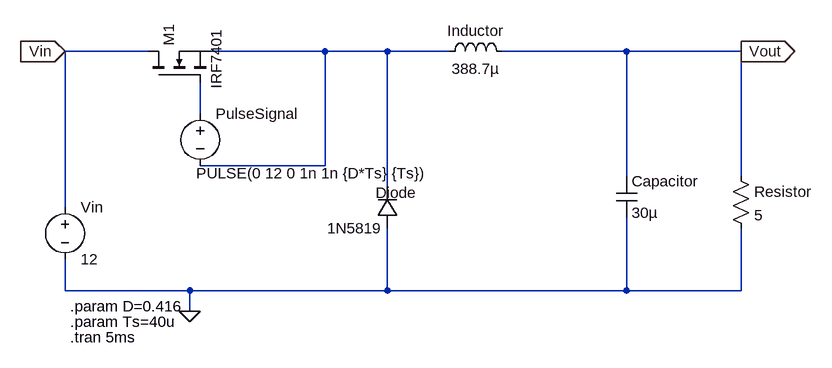
[diagram p0: schematic BuckConvertor.asc]
BuckConvertor.asc, the LTspice schematic file:
Version 4.1
SHEET 1 1068 680
WIRE 32 -80 -96 -80
WIRE 304 -80 128 -80
WIRE 400 -80 304 -80
WIRE 496 -80 400 -80
WIRE 768 -80 576 -80
WIRE 944 -80 768 -80
WIRE 112 16 112 -32
WIRE 304 96 304 -80
WIRE 304 96 112 96
WIRE 768 112 768 -80
WIRE 944 112 944 -80
WIRE 400 128 400 -80
WIRE -96 160 -96 -80
WIRE -96 288 -96 240
WIRE 96 288 -96 288
WIRE 400 288 400 192
WIRE 400 288 96 288
WIRE 768 288 768 176
WIRE 768 288 400 288
WIRE 944 288 944 192
WIRE 944 288 768 288
WIRE 96 320 96 288
FLAG 96 320 0
FLAG -96 -80 Vin
IOPIN -96 -80 In
FLAG 944 -80 Vout
IOPIN 944 -80 Out
SYMBOL ind 480 -64 R270
WINDOW 0 32 56 VTop 2
WINDOW 3 5 56 VBottom 2
SYMATTR InstName Inductor
SYMATTR Value 388.7µ
SYMATTR SpiceLine Rser=50m
SYMBOL cap 752 112 R0
SYMATTR InstName Capacitor
SYMATTR Value 30µ
SYMATTR SpiceLine Rser=5m
SYMBOL res 928 96 R0
SYMATTR InstName Resistor
SYMATTR Value 5
SYMBOL voltage 112 0 R0
WINDOW 3 -6 107 Left 2
WINDOW 123 0 0 Left 0
WINDOW 39 0 0 Left 0
SYMATTR InstName PulseSignal
SYMATTR Value PULSE(0 12 0 1n 1n {D*Ts} {Ts})
SYMBOL diode 416 192 R180
WINDOW 0 -29 55 Left 2
WINDOW 3 24 0 Left 2
SYMATTR InstName Diode
SYMATTR Value 1N5819
SYMBOL voltage -96 144 R0
WINDOW 123 0 0 Left 0
WINDOW 39 0 0 Left 0
SYMATTR InstName Vin
SYMATTR Value 12
SYMBOL nmos 32 -32 R270
WINDOW 3 -10 105 Left 2
SYMATTR InstName M1
SYMATTR Value IRF7401
TEXT -88 312 Left 2 !.param D=0.416
TEXT -88 336 Left 2 !.param Ts=40u
TEXT -88 360 Left 2 !.tran 5ms

The netlist it stands for:
* BuckConvertor.asc
L§Inductor N001 Vout 388.7µ Rser=50m
Capacitor Vout 0 30µ Rser=5m
Resistor Vout 0 5
V§PulseSignal N002 N001 PULSE(0 12 0 1n 1n {D*Ts} {Ts})
Diode 0 N001 1N5819
Vin Vin 0 12
M1 Vin N002 N001 N001 IRF7401
.model D D
.lib standard.dio
.model NMOS NMOS
.model PMOS PMOS
.lib standard.mos
.param D=0.416
.param Ts=40u
.tran 5ms
.backanno
.end